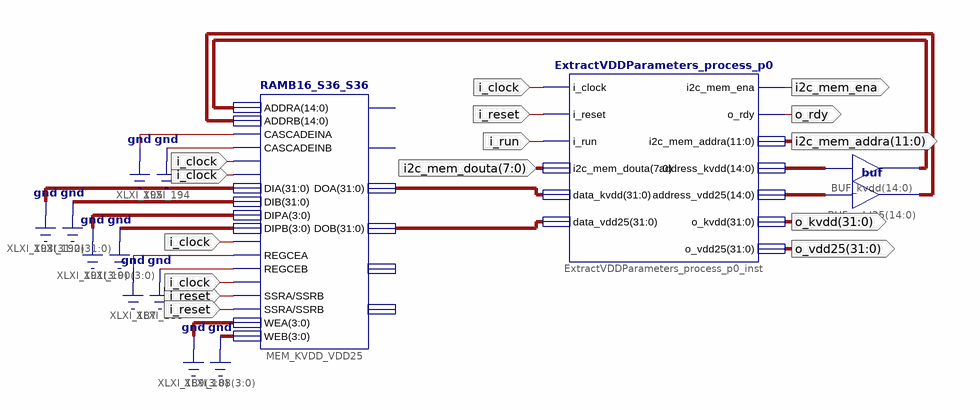
[diagram p0: schematic sheet 1]
// Xilinx ISE schematic ExtractVDDParameters.sch (spartan3e) as structural Verilog: 4 symbols, 9 ports
module ExtractVDDParameters (
  input  [7:0] i2c_mem_douta,
  input  i_run,
  input  i_reset,
  input  i_clock,
  output i2c_mem_ena,
  output [11:0] i2c_mem_addra,
  output o_rdy,
  output [31:0] o_kvdd,
  output [31:0] o_vdd25
);

  wire [14:0] ADDRA, ADDRB, XLXN_614, XLXN_615;
  wire [31:0] XLXN_605, XLXN_606;

  RAMB16_S36_S36 #(.INIT_10("c5720000c5740000c5760000c5780000c57a0000c57c0000c57e0000c5800000"), .INIT_0F("457e0000457c0000457a00004578000045760000457400004572000045700000"), .INIT_0E("456e0000456c0000456a00004568000045660000456400004562000045600000"), .INIT_0D("455e0000455c0000455a00004558000045560000455400004552000045500000"), .INIT_0C("454e0000454c0000454a00004548000045460000454400004542000045400000"), .INIT_0B("453e0000453c0000453a00004538000045360000453400004532000045300000"), .INIT_0A("452e0000452c0000452a00004528000045260000452400004522000045200000"), .INIT_09("451e0000451c0000451a00004518000045160000451400004512000045100000"), .INIT_08("450e0000450c0000450a00004508000045060000450400004502000045000000"), .INIT_07("44fc000044f8000044f4000044f0000044ec000044e8000044e4000044e00000"), .INIT_06("44dc000044d8000044d4000044d0000044cc000044c8000044c4000044c00000"), .INIT_05("44bc000044b8000044b4000044b0000044ac000044a8000044a4000044a00000"), .INIT_04("449c0000449800004494000044900000448c0000448800004484000044800000"), .INIT_03("4478000044700000446800004460000044580000445000004448000044400000"), .INIT_02("4438000044300000442800004420000044180000441000004408000044000000"), .INIT_01("43f0000043e0000043d0000043c0000043b0000043a000004390000043800000"), .INIT_00("4360000043400000432000004300000042c00000428000004200000022000000"), .INIT_1F("c2000000c2800000c2c00000c3000000c3200000c3400000c3600000c3800000"), .INIT_1E("c3900000c3a00000c3b00000c3c00000c3d00000c3e00000c3f00000c4000000"), .INIT_1D("c4080000c4100000c4180000c4200000c4280000c4300000c4380000c4400000"), .INIT_1C("c4480000c4500000c4580000c4600000c4680000c4700000c4780000c4800000"), .INIT_1B("c4840000c4880000c48c0000c4900000c4940000c4980000c49c0000c4a00000"), .INIT_1A("c4a40000c4a80000c4ac0000c4b00000c4b40000c4b80000c4bc0000c4c00000"), .INIT_19("c4c40000c4c80000c4cc0000c4d00000c4d40000c4d80000c4dc0000c4e00000"), .INIT_18("c4e40000c4e80000c4ec0000c4f00000c4f40000c4f80000c4fc0000c5000000"), .INIT_17("c5020000c5040000c5060000c5080000c50a0000c50c0000c50e0000c5100000"), .INIT_16("c5120000c5140000c5160000c5180000c51a0000c51c0000c51e0000c5200000"), .INIT_15("c5220000c5240000c5260000c5280000c52a0000c52c0000c52e0000c5300000"), .INIT_14("c5320000c5340000c5360000c5380000c53a0000c53c0000c53e0000c5400000"), .INIT_13("c5420000c5440000c5460000c5480000c54a0000c54c0000c54e0000c5500000"), .INIT_12("c5520000c5540000c5560000c5580000c55a0000c55c0000c55e0000c5600000"), .INIT_11("c5620000c5640000c5660000c5680000c56a0000c56c0000c56e0000c5700000"), .INIT_3F("c6008000c6010000c6018000c6020000c6028000c6030000c6038000c6040000"), .INIT_3E("c6048000c6050000c6058000c6060000c6068000c6070000c6078000c6080000"), .INIT_3D("c6088000c6090000c6098000c60a0000c60a8000c60b0000c60b8000c60c0000"), .INIT_3C("c60c8000c60d0000c60d8000c60e0000c60e8000c60f0000c60f8000c6100000"), .INIT_3B("c6108000c6110000c6118000c6120000c6128000c6130000c6138000c6140000"), .INIT_3A("c6148000c6150000c6158000c6160000c6168000c6170000c6178000c6180000"), .INIT_39("c6188000c6190000c6198000c61a0000c61a8000c61b0000c61b8000c61c0000"), .INIT_38("c61c8000c61d0000c61d8000c61e0000c61e8000c61f0000c61f8000c6200000"), .INIT_37("c6208000c6210000c6218000c6220000c6228000c6230000c6238000c6240000"), .INIT_36("c6248000c6250000c6258000c6260000c6268000c6270000c6278000c6280000"), .INIT_35("c6288000c6290000c6298000c62a0000c62a8000c62b0000c62b8000c62c0000"), .INIT_34("c62c8000c62d0000c62d8000c62e0000c62e8000c62f0000c62f8000c6300000"), .INIT_33("c6308000c6310000c6318000c6320000c6328000c6330000c6338000c6340000"), .INIT_32("c6348000c6350000c6358000c6360000c6368000c6370000c6378000c6380000"), .INIT_31("c6388000c6390000c6398000c63a0000c63a8000c63b0000c63b8000c63c0000"), .INIT_30("c63c8000c63d0000c63d8000c63e0000c63e8000c63f0000c63f8000c6400000"), .INIT_2F("c6408000c6410000c6418000c6420000c6428000c6430000c6438000c6440000"), .INIT_2E("c6448000c6450000c6458000c6460000c6468000c6470000c6478000c6480000"), .INIT_2D("c6488000c6490000c6498000c64a0000c64a8000c64b0000c64b8000c64c0000"), .INIT_2C("c64c8000c64d0000c64d8000c64e0000c64e8000c64f0000c64f8000c6500000"), .INIT_2B("c6508000c6510000c6518000c6520000c6528000c6530000c6538000c6540000"), .INIT_2A("c6548000c6550000c6558000c6560000c6568000c6570000c6578000c6580000"), .INIT_29("c6588000c6590000c6598000c65a0000c65a8000c65b0000c65b8000c65c0000"), .INIT_28("c65c8000c65d0000c65d8000c65e0000c65e8000c65f0000c65f8000c6600000"), .INIT_27("c6608000c6610000c6618000c6620000c6628000c6630000c6638000c6640000"), .INIT_26("c6648000c6650000c6658000c6660000c6668000c6670000c6678000c6680000"), .INIT_25("c6688000c6690000c6698000c66a0000c66a8000c66b0000c66b8000c66c0000"), .INIT_24("c66c8000c66d0000c66d8000c66e0000c66e8000c66f0000c66f8000c6700000"), .INIT_23("c6708000c6710000c6718000c6720000c6728000c6730000c6738000c6740000"), .INIT_22("c6748000c6750000c6758000c6760000c6768000c6770000c6778000c6780000"), .INIT_21("c6788000c6790000c6798000c67a0000c67a8000c67b0000c67b8000c67c0000"), .INIT_20("c67c8000c67d0000c67d8000c67e0000c67e8000c67f0000c67f8000c6800000"), .SIM_COLLISION_CHECK("NONE"), .READ_WIDTH_B(36), .READ_WIDTH_A(36)) MEM_KVDD_VDD25 (
    .ADDRA(ADDRA), .ADDRB(ADDRB), .CASCADEINA(1'b0), .CASCADEINB(1'b0), .CLKA(i_clock), .CLKB(i_clock),
    .DIA({32{1'b0}}), .DIB({32{1'b0}}), .DIPA(4'b0000), .DIPB(4'b0000), .ENA(i_clock), .REGCEA(1'b0),
    .REGCEB(1'b0), .ENB(i_clock), .SSRA(i_reset), .SSRB(i_reset), .WEA(4'b0000), .WEB(4'b0000),
    .DOA(XLXN_605), .DOB(XLXN_606));  // open: CASCADEOUTA, CASCADEOUTB, DOPA, DOPB
  assign ADDRA = XLXN_614;  // buf BUF_kvdd[14..0], 15 bits wide
  assign ADDRB = XLXN_615;  // buf BUF_vdd25[14..0], 15 bits wide
  ExtractVDDParameters_process_p0 ExtractVDDParameters_process_p0_inst (
    .i_clock(i_clock), .i_reset(i_reset), .i_run(i_run), .i2c_mem_douta(i2c_mem_douta), .data_kvdd(XLXN_605),
    .data_vdd25(XLXN_606), .i2c_mem_ena(i2c_mem_ena), .o_rdy(o_rdy), .i2c_mem_addra(i2c_mem_addra),
    .address_kvdd(XLXN_614), .address_vdd25(XLXN_615), .o_kvdd(o_kvdd), .o_vdd25(o_vdd25));
endmodule
